# EAGLE design spdif2analog (EAGLE 6.1)
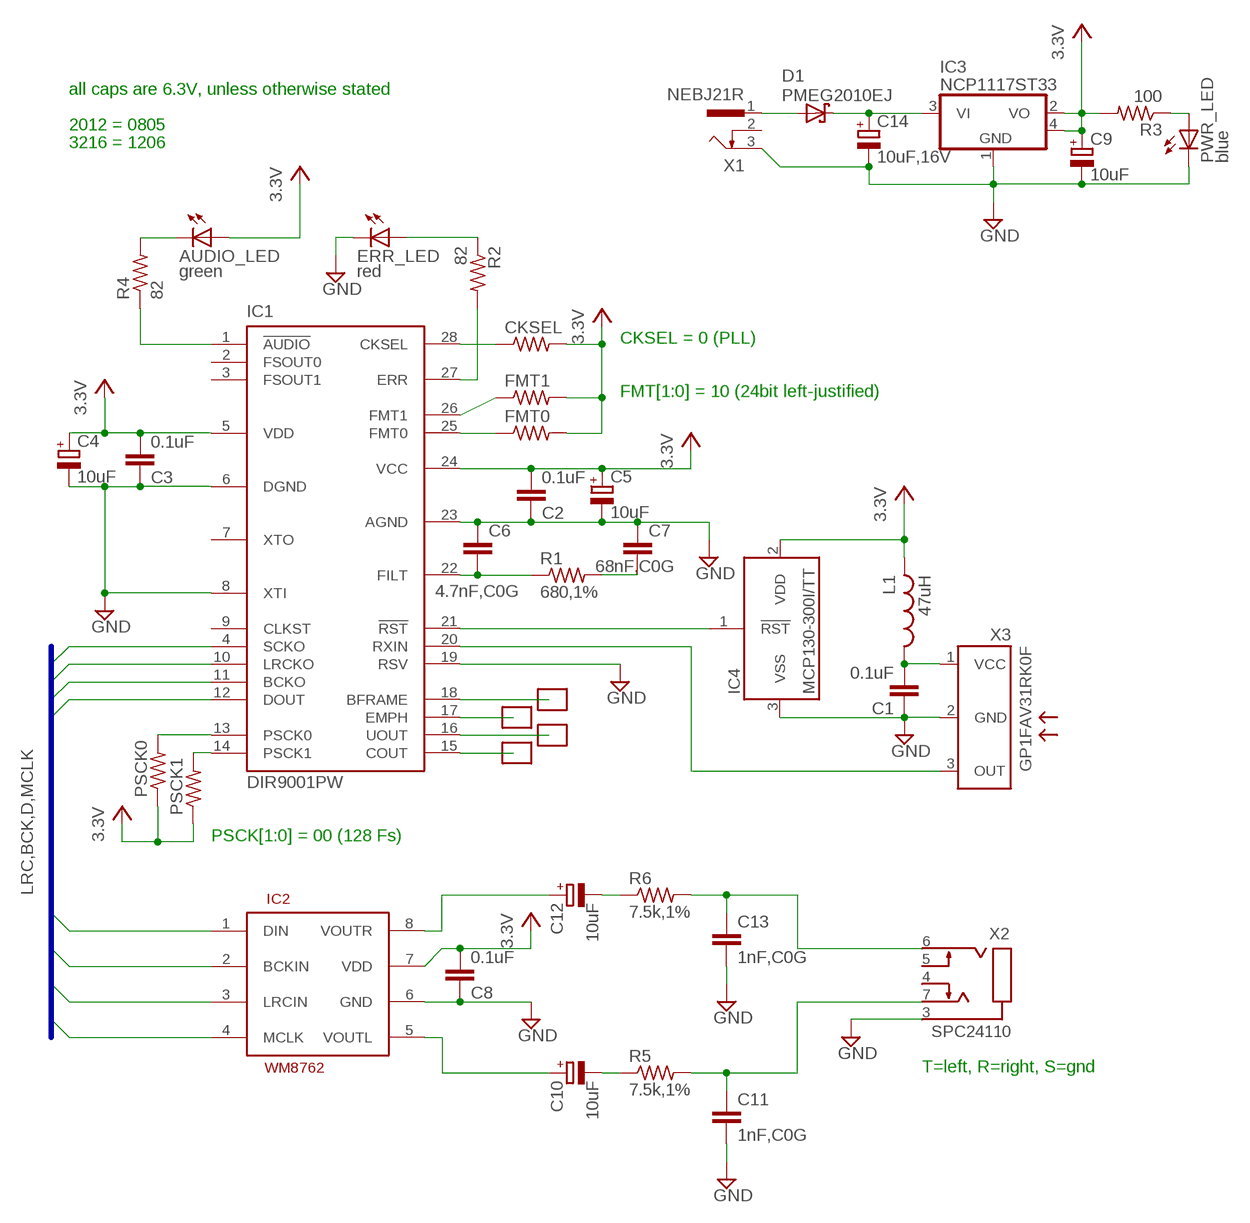
[diagram p0: schematic, sheet 1]

## Parts
AUDIO_LED  green  LEDCHIPLED_0805  [CHIPLED_0805]
C1  0.1uF  C-EUC0805  [C0805]
C2  0.1uF  C-EUC0805  [C0805]
C3  0.1uF  C-EUC0805  [C0805]
C4  10uF  CPOL-EUA/3216-18R  [A/3216-18R]
C5  10uF  CPOL-EUA/3216-18R  [A/3216-18R]
C6  4.7nF,C0G  C-EUC0805  [C0805]
C7  68nF,C0G  C-EU025_050-035X075  [C025_050-035X075]
C8  0.1uF  C-EUC0805  [C0805]
C9  10uF  CPOL-EUA/3216-18R  [A/3216-18R]
C10  10uF  CPOL-EUA/3216-18R  [A/3216-18R]
C11  1nF,C0G  C-EUC0805  [C0805]
C12  10uF  CPOL-EUA/3216-18R  [A/3216-18R]
C13  1nF,C0G  C-EUC0805  [C0805]
C14  10uF,16V  CPOL-EUA/3216-18R  [A/3216-18R]
CKSEL  5.1k  R-US_R0805  [R0805]
D1  PMEG2010EJ  [SOD-323]
ERR_LED  red  LEDCHIPLED_0805  [CHIPLED_0805]
FMT0  5.1k  R-US_R0805  [R0805]
FMT1  5.1k  R-US_R0805  [R0805]
IC1  DIR9001PW  [PW_R-PDSO-G28]
IC2  WM8762  [SOIC8]
IC3  NCP1117ST33  [SOT-223]
IC4  MCP130-300I/TT  [SOT-23-3]
L1  47uH  L-USL2012C  [L2012C]
PSCK0  5.1k  R-US_R0805  [R0805]
PSCK1  5.1k  R-US_R0805  [R0805]
PWR_LED  blue  LEDCHIPLED_0805  [CHIPLED_0805]
R1  680,1%  R-US_R0805  [R0805]
R2  82  R-US_R0805  [R0805]
R3  100  R-US_R0805  [R0805]
R4  82  R-US_R0805  [R0805]
R5  7.5k,1%  R-US_R0805  [R0805]
R6  7.5k,1%  R-US_R0805  [R0805]
U$1  PAD.015  [PAD.015]
U$2  PAD.015  [PAD.015]
U$3  PAD.015  [PAD.015]
U$4  PAD.015  [PAD.015]
X1  NEBJ21R  [NEBJ21R]
X2  SPC24110  [SPC24110]
X3  GP1FAV31RK0F  [GP1FAV31RK0F]

## Nets
3.3V: AUDIO_LED.A C2.2 C3.2 C4.+ C5.+ C8.2 C9.+ CKSEL.2 FMT0.2 FMT1.2 IC1.5(VDD) IC1.24(VCC) IC2.7(VDD) IC3.2(VO) IC3.4(TAB) IC4.2(VDD) L1.2 PSCK0.1 PSCK1.1 R3.2
BCK: IC1.11(BCKO) IC2.2(BCKIN)
D: IC1.12(DOUT) IC2.1(DIN)
GND: C1.1 C2.1 C3.1 C4.- C5.- C6.1 C7.1 C8.1 C9.- C11.2 C13.2 C14.- ERR_LED.C IC1.6(DGND) IC1.8(XTI) IC1.19(RSV) IC1.23(AGND) IC2.6(GND) IC3.1(GND) IC4.3(VSS) PWR_LED.C X1.3 X2.3(SLEEVE) X3.2(GND)
LRC: IC1.10(LRCKO) IC2.3(LRCIN)
MCLK: IC1.4(SCKO) IC2.4(MCLK)
N$1: C1.2 L1.1 X3.1(VCC)
N$2: IC1.21(!RST) IC4.1(!RST)
N$3: C7.2 R1.2
N$4: IC1.20(RXIN) X3.3(OUT)
N$5: C6.2 IC1.22(FILT) R1.1
N$6: IC1.13(PSCK0) PSCK0.2
N$7: D1.2(A) X1.1
N$8: IC1.14(PSCK1) PSCK1.2
N$9: FMT1.1 IC1.26(FMT1)
N$10: FMT0.1 IC1.25(FMT0)
N$11: CKSEL.1 IC1.28(CKSEL)
N$12: ERR_LED.A R2.1
N$13: IC1.27(ERR) R2.2
N$14: C10.+ IC2.5(VOUTL)
N$15: PWR_LED.A R3.1
N$16: C12.+ IC2.8(VOUTR)
N$17: C13.1 R6.2 X2.6(RING)
N$18: C11.1 R5.2 X2.7(TIP)
N$19: IC1.18(BFRAME) U$1.1(P)
N$20: IC1.17(EMPH) U$2.1(P)
N$21: IC1.16(UOUT) U$3.1(P)
N$22: IC1.15(COUT) U$4.1(P)
N$23: AUDIO_LED.C R4.2
N$24: C12.- R6.1
N$25: IC1.1(!AUDIO) R4.1
N$26: C14.+ D1.1(C) IC3.3(VI)
N$27: C10.- R5.1
Unconnected: IC1.2(FSOUT0) IC1.3(FSOUT1) IC1.7(XTO) IC1.9(CLKST) X1.2 X2.4(SHUNT_B) X2.5(SHUNT_A)

## Buses
LRC,BCK,D,MCLK

## Notes on the sheet
- all caps are 6.3V, unless otherwise stated
- 2012 = 0805
- 3216 = 1206
- CKSEL = 0 (PLL)
- FMT[1:0] = 10 (24bit left-justified)
- PSCK[1:0] = 00 (128 Fs)
- T=left, R=right, S=gnd

## Library data of the parts
AUDIO_LED ERR_LED PWR_LED = led:LED: LED OSRAM: - CHIPLED LG R971, LG N971, LY N971, LG Q971, LY Q971, LO R971, LY R971 LH N974, LH R974 LS Q976, LO Q976, LY Q976 LO Q996 - Hyper CHIPLED LW Q18S LB Q993, LB Q99A, LB R99A - SideLED LS A670, LO A670, LY A670, LG A670, LP A670 LB A673, LV A673, LT A673, LW A673 LH A674 LY A675 LS A676, LA A676, LO A676, LY A676, LW A676 LS A679, LY A679, LG A679 - Hyper Micro SIDELED® LS Y876, LA Y876, LO Y876, LY Y876 LT Y87S - SmartLED LW L88C, LW L88S LB L89C, LB L89S, LG L890 LS L89K, LO L89K, LY L89K LS L896, LA L896, LO L896, LY L896 - TOPLED LS T670, LO T670, LY T670, LG T670, LP T670 LSG T670, LSP T670, LSY T670, LOP T670, LYG T670 LG T671, LOG T671, LSG T671 LB T673, LV T673, LT T673, LW T673 LH T674 LS T676, LA T676, LO T676, LY T676, LB T676, LH T676, LSB T676, LW T676 LB T67C, LV T67C, LT T67C, LS T67K, LO T67K, LY T67K, LW E67C LS E67B, LA E67B, LO E67B, LY E67B, LB E67C, LV E67C, LT E67C LW T67C LS T679, LY T679, LG T679 LS T770, LO T770, LY T770, LG T770, LP T770 LB T773, LV T773, LT T773, LW T773 LH T774 LS E675, LA E675, LY E675, LS T675 LS T776, LA T776, LO T776, LY T776, LB T776 LHGB T686 LT T68C, LB T68C - Hyper Mini TOPLED® LB M676 - Mini TOPLED Santana® LG M470 LS M47K, LO M47K, LY M47K Source: http://www.osram.convergy.de LUXEON: - LUMILED® LXK2-PW12-R00, LXK2-PW12-S00, LXK2-PW14-U00, LXK2-PW14-V00 LXK2-PM12-R00, LXK2-PM12-S00, LXK2-PM14-U00 LXK2-PE12-Q00, LXK2-PE12-R00, LXK2-PE12-S00, LXK2-PE14-T00, LXK2-PE14-U00 LXK2-PB12-K00, LXK2-PB12-L00, LXK2-PB12-M00, LXK2-PB14-N00, LXK2-PB14-P00, LXK2-PB14-Q00 LXK2-PR12-L00, LXK2-PR12-M00, LXK2-PR14-Q00, LXK2-PR14-R00 LXK2-PD12-Q00, LXK2-PD12-R00, LXK2-PD12-S00 LXK2-PH12-R00, LXK2-PH12-S00 LXK2-PL12-P00, LXK2-PL12-Q00, LXK2-PL12-R00 Source: www.luxeon.com KINGBRIGHT: KA-3528ASYC Source: www.kingbright.com
C1-C3 C6-C8 C11 C13 = rcl:C-EU: CAPACITOR, European symbol
C4 C5 C9 C10 C12 C14 = rcl:CPOL-EU: POLARIZED CAPACITOR, European symbol
CKSEL FMT0 FMT1 PSCK0 PSCK1 R1-R6 = rcl:R-US_: RESISTOR, American symbol
D1 = gm:PMEG2010E*: DIODE barrier diode
IC1 = gm:DIR9001: Digital Audio Interface Receiver, 96 kHz, 24 bit Burr-Brown
IC2 = gm:WM8762: 24 bit 192 kHz Stereo DAC Wolfson Microelectronics
IC3 = gm:NCP1117: 1A LDO Positive Voltage Regulator On Semiconductor
IC4 = gm:MCP130-*I: Supervisor circuit with open drain & internal pull-up Microchip Technology Inc.
L1 = rcl:L-US: INDUCTOR, American symbol
U$1-U$4 = gm:PAD
X1 = con-lumberg:NEBJ21R: Netzgeräte-Einbaukupplung abgewinkelte Ausführung mit Öffner Source: http://www.lumberg.com/Produkte/PDFs/NEB_J21R.pdf MARUSHIN ELECTRIC MFG.CO. LTD - Draw No: MJ196P - NEB J 21 R.pdf; MPN: NEB/J 21 R; OC_FARNELL: 1217039; OC_NEWARK: 97K6460
X2 = gm:SPC24110: SPC24110 3.5mm 3-way Stereo Jack SPC Technology carried exclusively by Farnell / Newark / element14
X3 = gm:GP1FAV*1RK0F: Fibre Optic Receiver, Square Connector with Mounting Hole & Shutter SHARP Datasheet: http://document.sharpsma.com/files/gp1fav31rk_e.pdf

## Board
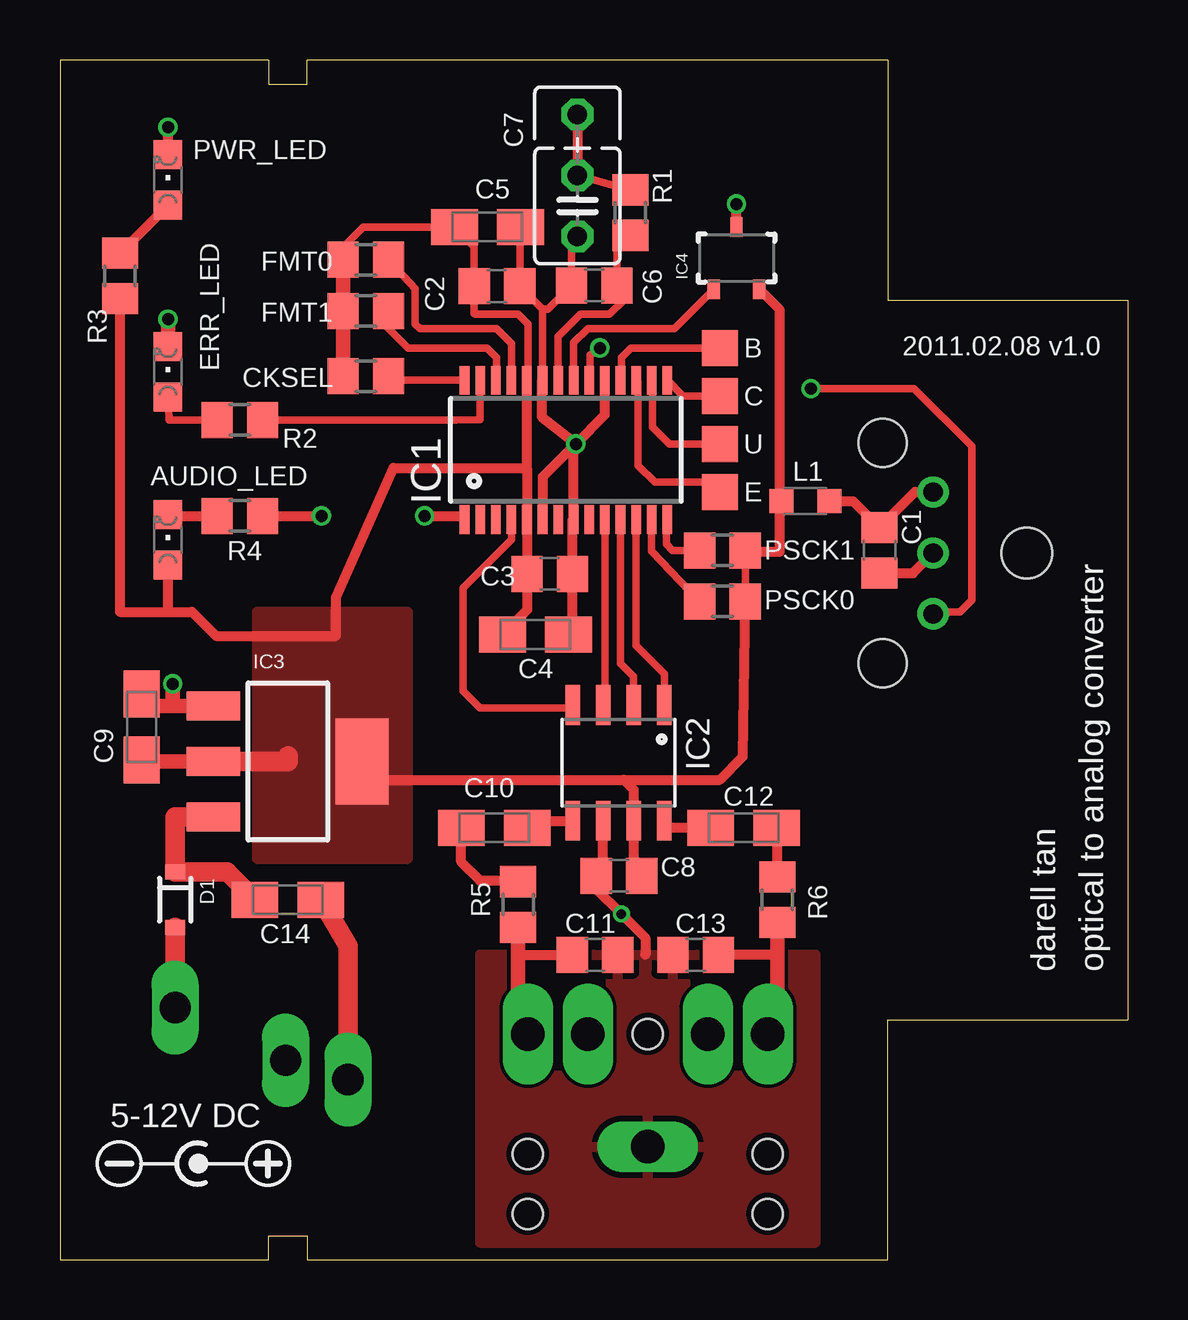
[diagram p1: board, top side]
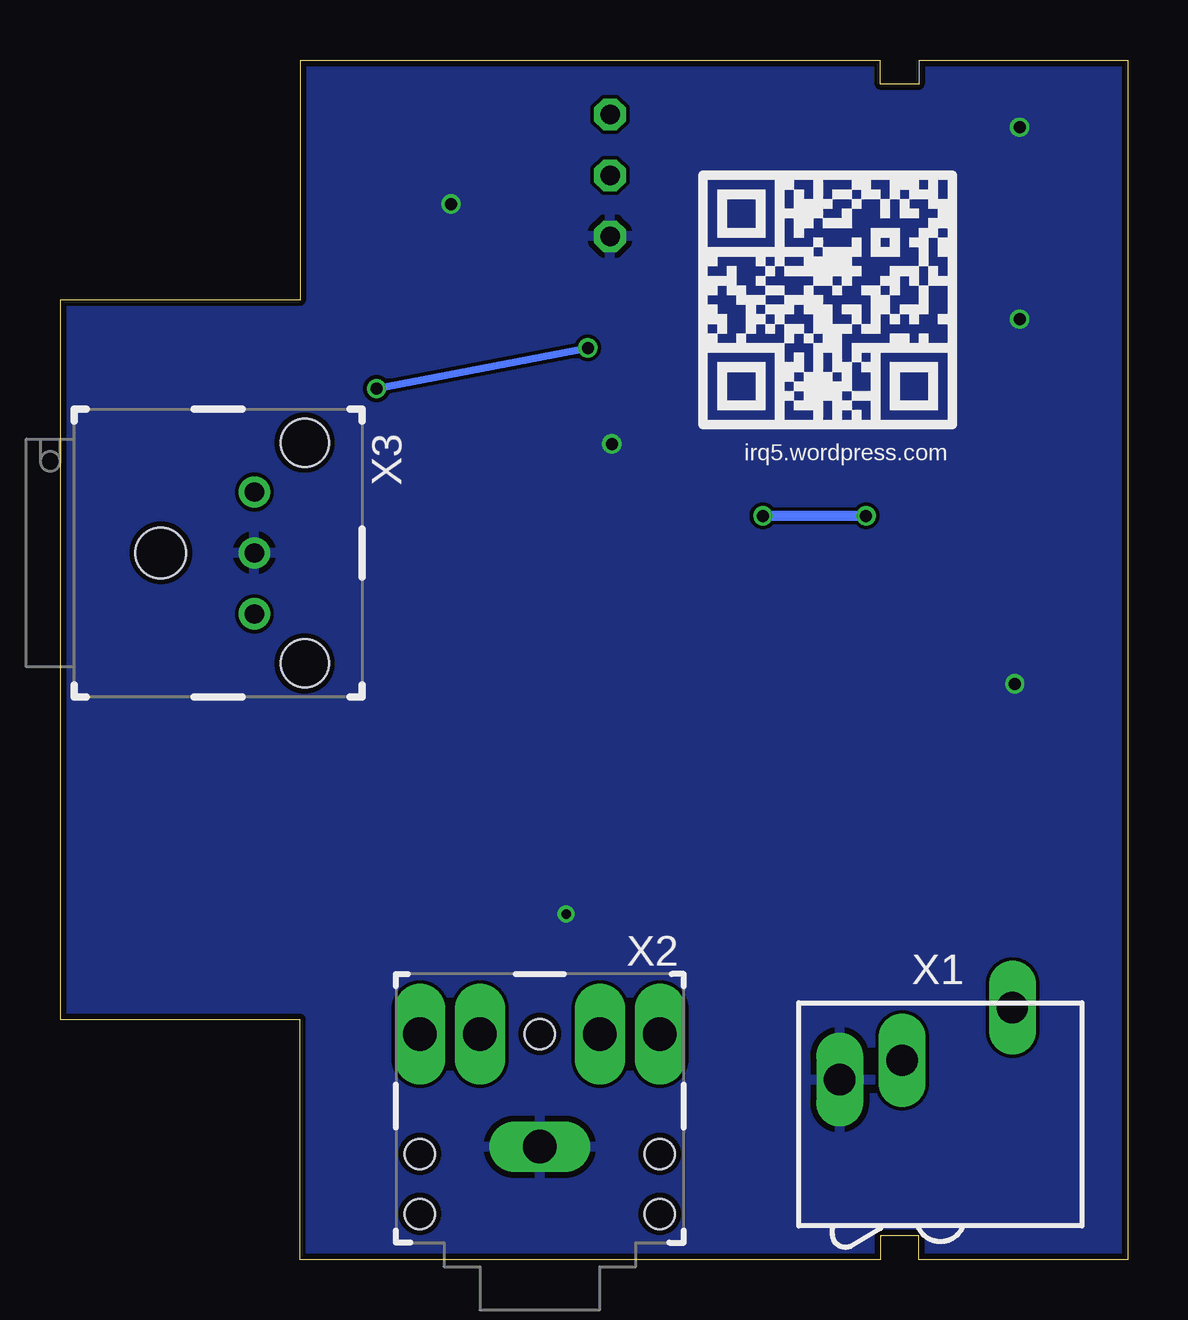
[diagram p2: board, bottom side, seen from below]

Size 44.5 x 50 mm. Coordinates in mm from the lower left corner, seen from the top.
Outline: 0,0 8.7,0 8.7,1 10.3,1 10.3,0 34.5,0 34.5,10 44.5,10 44.5,40 34.5,40 34.5,50 10.3,50 10.3,49 8.7,49 8.7,50 0,50 0,0
Copper layers (1*16): Top 0.035mm / dielectric 1.5mm / Bottom 0.035mm
Design rules: minimum track width 6mil, minimum drill 12mil, track to track 6mil, track to pad 6mil, pad to pad 6mil, via to via 6mil, smd to smd 0mil, copper to edge 10mil, drill to drill 10mil, minimum pad ring 10mil, minimum via ring 6mil, stop-mask expansion 2mil, vias tented up to drill 100mil, thermal gap 10mil

### Footprints (pad centres in the part's own frame; a part is rotated, then mirrored left to right if it is on the bottom)
CHIPLED_0805 = smd 1.2 x 1.2: A 0,-1.05; C 0,1.05
C0805 = smd 1.3 x 1.5: 1 -0.95,0; 2 0.95,0
A/3216-18R = smd 1.95 x 1.5: + 1.375,0; - -1.375,0
C025_050-035X075 = drill 0.813 octagon: 1 -1.27,0; 2 1.27,0; 3 3.81,0
R0805 = smd 1.3 x 1.5: 1 -0.95,0; 2 0.95,0
SOD-323 = smd 0.63 x 0.83: 1 -1.15,0; 2 1.15,0
PW_R-PDSO-G28 = smd 0.4 x 1.2: 1 -4.225,-2.9; 2 -3.575,-2.9; 3 -2.925,-2.9; 4 -2.275,-2.9; 5 -1.625,-2.9; 6 -0.975,-2.9; 7 -0.325,-2.9; 8 0.325,-2.9; 9 0.975,-2.9; 10 1.625,-2.9; 11 2.275,-2.9; 12 2.925,-2.9; 13 3.575,-2.9; 14 4.225,-2.9; 15 4.225,2.9; 16 3.575,2.9; 17 2.925,2.9; 18 2.275,2.9; 19 1.625,2.9; 20 0.975,2.9; 21 0.325,2.9; 22 -0.325,2.9; 23 -0.975,2.9; 24 -1.625,2.9; 25 -2.275,2.9; 26 -2.925,2.9; 27 -3.575,2.9; 28 -4.225,2.9
SOIC8 = smd 0.61 x 1.651: 1 -1.905,-2.413; 2 -0.635,-2.413; 3 0.635,-2.413; 4 1.905,-2.413; 5 1.905,2.413; 6 0.635,2.413; 7 -0.635,2.413; 8 -1.905,2.413
SOT-223 = smd 1.219 x 2.235: 1 -2.311,-3.099; 2 0,-3.099; 3 2.311,-3.099 | smd 3.6 x 2.2: 4 0,3.099
SOT-23-3 = smd 0.51 x 0.8: 1 -0.95,-1.3; 2 0.95,-1.3; 3 0,1.3
L2012C = smd 1 x 1: 1 -1,0; 2 1,0
PAD.015 = smd 1.5 x 1.5: 1 0,0
NEBJ21R = drill 1.3 pad 1.905 long: 1 -3,-9.2; 2 1.6,-7; 3 4.2,-6.2
SPC24110 = drill 1.4 long: 3 -0.2,0; 4 4.5,-2.5; 5 4.5,2.5; 6 4.5,5; 7 4.5,-5 | hole 1.25: -3,5; -0.5,5; -3,-5; -0.5,-5; 4.5,0
GP1FAV31RK0F = drill 0.8: 1 -1.5,-2.54; 2 -1.5,0; 3 -1.5,2.54 | hole 2.1: 2.4,0 | hole 2: -3.6,4.6; -3.6,-4.6

### Placement (x,y rotation side)
AUDIO_LED  4.5,30 0 top
C1  34.16,29.56 90 top
C2  18.22,40.57 180 top
C3  20.42,28.58 180 top
C4  19.82,26.05 180 top
C5  17.82,43.04 180 top
C6  22.27,40.6 0 top
C7  21.57,43.92 90 top
C8  23.3,16 0 top
C9  3.4,22.2 270 top
C10  18.1,18 0 top
C11  22.3,12.7 0 top
C12  28.5,18 180 top
C13  26.5,12.7 180 top
C14  9.5,15 180 top
CKSEL  12.75,36.82 180 top
D1  4.8,15 270 top
ERR_LED  4.5,37 0 top
FMT0  12.75,41.67 180 top
FMT1  12.75,39.54 180 top
IC1  21.09,33.75 0 top
IC2  23.28,20.7 180 top
IC3  9.5,20.76 270 top
IC4  28.2,41.74 0 top
L1  31.06,31.61 180 top
PSCK0  27.62,27.43 180 top
PSCK1  27.62,29.56 180 top
PWR_LED  4.5,45 0 top
R1  23.77,43.64 90 top
R2  7.5,35 0 top
R3  2.5,41 270 top
R4  7.5,31 180 top
R5  19.1,14.8 270 top
R6  29.9,15 270 top
U$1  27.5,38 0 top
U$2  27.5,32 0 top
U$3  27.5,34 0 top
U$4  27.5,36 0 top
U$5  [SILK-IRQ5_QR_CODE]  12.5,40 90 bottom
U$6  5-12V DC  [SILK-DC_JACK_POL_A]  5.5,5 0 top
X1  7.8,1.3 180 bottom
X2  24.5,4.9 90 bottom
X3  37.9,29.45 180 bottom

### Tracks (layer width: path | path; a pad name or v marks a point on that pad's centre or on a via)
3.3V
  Top 0.305: PSCK0.1 PSCK1.1 | 19.5,36.65 IC1.24 19.5,36.69 19.5,39 19.1,39.4 17.3,39.4 17.27,39.43 C2.2 17.27,42.22 C5.+ 12.64,43.04 11.9,42.3 11.9,41.67 FMT0.2
  Top 0.406: 19.46,33 IC1.5 C3.2 19.47,27.07 C4.+ | 19.46,33 IC1.24 | 28.15,29.56 PSCK1.1 28.51,29.51 30,29.51 | C8.2 23.91,16.34 IC2.7 23.91,19.59 23.5,20 | 13.36,20 23.5,20 | 23.5,20 27.5,20 28.47,20.97 PSCK0.1 | 19.46,33 13.9,33 11.5,27.6 11.5,26 6.5,26 5.5,27 2.5,27 | 2.5,27 R3.2 | IC4.2 30,39.59 30,29.51 | 30,29.51 30,31.34 L1.2 | AUDIO_LED.A 4.5,27 2.5,27
  Top 0.61: FMT0.2 FMT1.2 CKSEL.2 | C9.+ 3.2,20.76 IC3.2
  Top 0.813: IC3.2 9.5,20.76 9.5,21
  pour Top (isolate 0.254, no thermals): 14.5,27 8.2,27 8.2,16.7 14.5,16.7
BCK
  Top 0.305: IC1.11 23.36,24.84 23.9,24.3 23.9,23.13 IC2.2
D
  Top 0.305: IC1.12 24.02,25.59 25.2,24.4 25.2,23.13 IC2.1
GND  (via drill 0.4, 0.5)
  Top 0.305: IC1.23 20.11,39.62 | 21.41,33.91 v21.5,34 | 21.37,30.85 IC1.8 | 20.11,39.62 C2.1 19.17,43.02 C5.- | 20.11,39.62 20.34,39.62 C6.1 21.32,42.42 C7.1
  Top 0.406: IC1.23 20.1,35.1 v21.5,34 22.71,35.22 IC1.19 | IC1.6 20.11,32.62 21.41,33.91 IC1.8 | IC4.3 v28.2,44 | 21.37,26.23 C3.1 21.37,30.85 | PWR_LED.C v4.5,47.2 | IC2.6 22.64,16.3 C8.1 22.35,15.45 v23.4,14.4 24.4,13.4 24.4,12.7 | C1.1 35.56,28.61 X3.2
  Top 0.61: ERR_LED.C v4.5,39.2 | C9.- 3.7,23.07 4.5,23.07 | 4.5,23.07 IC3.1 | v4.7,24 4.7,23.07 4.5,23.07
  Top 0.813: C4.- 21.37,26.23 | C14.- 12,13.07 X1.3
  pour Bottom: -5.5,50 -5.5,0 44.5,0 44.5,50
  pour Top: 17.5,12.7 17.5,0.7 31.5,0.7 31.5,12.7
LRC
  Top 0.305: IC1.10 22.71,23.18 IC2.3
MCLK
  Top 0.305: IC1.4 18.82,30.02 16.8,28 16.8,24.7 16.8,23.7 17.5,23 21.26,23 IC2.4
N$1
  Top 0.406: L1.1 33.06,31.61 C1.2 35.64,31.99 X3.1
N$2
  Top 0.305: IC1.21 21.41,38.22 22,38.8 25.61,38.8 IC4.1
N$3
  Top 0.305: C7.2 23.76,44.57 R1.2
  Top 0.406: 21.6,45.2 21.6,47.7
  Top 0.61: 21.6,45.2 21.6,45.19 C7.2
N$4  (via drill 0.5)
  Top 0.305: IC1.20 22.1,36.69 22.1,37.7 v22.5,38 | v31.3,36.3 35.6,36.3 38,33.9 38,27.5 37.5,27 36.49,27 X3.3
  Bottom 0.305: v22.5,38 v31.3,36.3
N$5
  Top 0.305: IC1.22 20.77,38.47 21.7,39.4 22.9,39.4 23.5,40 23.5,40.32 C6.2 23.22,42.13 R1.1
N$6
  Top 0.305: IC1.13 24.66,29.53 PSCK0.2
N$7
  Top 0.813: X1.1 D1.2
N$8
  Top 0.305: IC1.14 25.28,30.82 25.28,29.81 25.54,29.56 PSCK1.2
N$9
  Top 0.305: IC1.26 18.2,36.69 18.2,37.6 17.8,38 14.5,38 13.6,38.9 FMT1.1
N$10
  Top 0.305: IC1.25 18.82,38.19 18.2,38.8 15,38.8 14.8,39 14.8,40.47 FMT0.1
N$11
  Top 0.305: IC1.28 13.77,36.65 CKSEL.1
N$12
  Top 0.305: R2.1 4.55,35 ERR_LED.A
N$13
  Top 0.305: IC1.27 17.52,35.02 16.5,35 R2.2
N$14
  Top 0.406: C10.+ 20.16,18.29 IC2.5
N$15
  Top 0.406: R3.1 PWR_LED.A
N$16
  Top 0.406: IC2.8 25.47,18 C12.+
N$17
  Top 0.406: 29.9,12.7 C13.1 | 29.9,9.6 29.7,9.6 X2.6
  Top 0.61: R6.2 29.9,12.7 29.9,9.6
N$18
  Top 0.406: 19.1,12.7 C11.1 | 19.1,9.6 19.3,9.6 X2.7
  Top 0.61: 19.1,9.6 19.1,12.7 R5.2
N$19
  Top 0.305: IC1.18 23.4,36.69 23.4,37.6 23.8,38 U$1.1
N$20
  Top 0.305: IC1.17 24.1,36.56 24.1,33.1 24.8,32.4 26.8,32.4 27.2,32 U$2.1
N$21
  Top 0.305: IC1.16 24.7,36.62 24.7,34.7 25.4,34 U$3.1
N$22
  Top 0.305: IC1.15 25.96,36 U$4.1
N$23
  Top 0.406: AUDIO_LED.C 4.55,31 R4.2
N$24
  Top 0.406: C12.- 29.9,17.98 R6.1
N$25  (via drill 0.5)
  Top 0.406: IC1.1 16.71,31 v15.2,31 | R4.1 v10.9,31
  Bottom 0.406: v10.9,31 v15.2,31
N$26
  Top 0.813: IC3.3 4.8,18.45 D1.1 6.97,16.15 C14.+
N$27
  Top 0.406: C10.- 16.73,16.57 17.5,15.8 19.05,15.8 R5.1

### Text on the board
tNames: B | 2011.02.08 v1.0 | C | U | E | darell tan | optical to analog converter